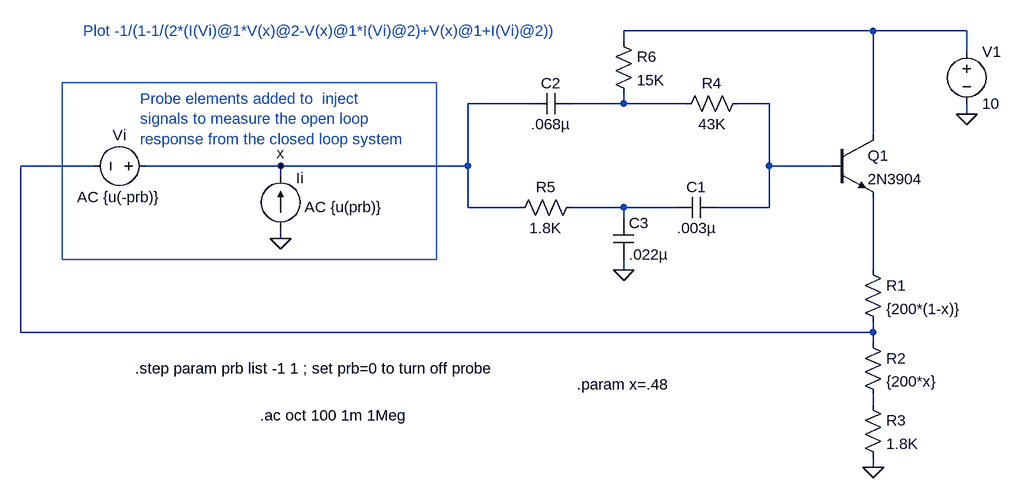
[diagram p0: schematic FollowerOSCsmallsig.asc]
FollowerOSCsmallsig.asc, the LTspice schematic file:
Version 4
SHEET 1 880 740
WIRE 352 -32 -32 -32
WIRE 496 -32 352 -32
WIRE -32 -16 -32 -32
WIRE 496 0 496 -32
WIRE -176 80 -272 80
WIRE -32 80 -32 64
WIRE -32 80 -112 80
WIRE 64 80 -32 80
WIRE 192 80 144 80
WIRE 496 96 496 80
WIRE 352 128 352 -32
WIRE -848 176 -960 176
WIRE -560 176 -768 176
WIRE -272 176 -272 80
WIRE -272 176 -560 176
WIRE 192 176 192 80
WIRE 288 176 192 176
WIRE -560 192 -560 176
WIRE -272 240 -272 176
WIRE -192 240 -272 240
WIRE -32 240 -112 240
WIRE 48 240 -32 240
WIRE 192 240 192 176
WIRE 192 240 112 240
WIRE -32 256 -32 240
WIRE -560 288 -560 272
WIRE -32 336 -32 320
WIRE 352 336 352 224
WIRE -960 432 -960 176
WIRE 352 432 352 416
WIRE 352 432 -960 432
WIRE 352 448 352 432
WIRE 352 544 352 528
WIRE 352 640 352 624
FLAG 352 640 0
FLAG -32 336 0
FLAG 496 96 0
FLAG -560 288 0
FLAG -560 176 x
SYMBOL npn 288 128 R0
SYMATTR InstName Q1
SYMATTR Value 2N3904
SYMBOL res 336 320 R0
SYMATTR InstName R1
SYMATTR Value {200*(1-x)}
SYMBOL res 336 432 R0
SYMATTR InstName R2
SYMATTR Value {200*x}
SYMBOL res 336 528 R0
SYMATTR InstName R3
SYMATTR Value 1.8K
SYMBOL res 160 64 R90
WINDOW 0 0 56 VBottom 2
WINDOW 3 32 56 VTop 2
SYMATTR InstName R4
SYMATTR Value 43K
SYMBOL res -96 224 R90
WINDOW 0 0 56 VBottom 2
WINDOW 3 32 56 VTop 2
SYMATTR InstName R5
SYMATTR Value 1.8K
SYMBOL res -48 -32 R0
SYMATTR InstName R6
SYMATTR Value 15K
SYMBOL cap 112 224 R90
WINDOW 0 0 32 VBottom 2
WINDOW 3 32 32 VTop 2
SYMATTR InstName C1
SYMATTR Value .003µ
SYMBOL cap -112 64 R90
WINDOW 0 0 32 VBottom 2
WINDOW 3 32 32 VTop 2
SYMATTR InstName C2
SYMATTR Value .068µ
SYMBOL cap -48 256 R0
SYMATTR InstName C3
SYMATTR Value .022µ
SYMBOL voltage 496 -16 R0
SYMATTR InstName V1
SYMATTR Value 10
SYMBOL current -560 272 M180
WINDOW 0 24 77 Left 2
WINDOW 3 24 0 Left 2
WINDOW 123 37 33 Left 2
WINDOW 39 0 0 Left 2
SYMATTR InstName Ii
SYMATTR Value ""
SYMATTR Value2 AC {u(prb)}
SYMBOL voltage -752 176 M270
WINDOW 0 32 56 VTop 2
WINDOW 3 -32 56 VBottom 2
WINDOW 123 -32 56 VBottom 2
WINDOW 39 -32 56 VBottom 2
SYMATTR InstName Vi
SYMATTR Value ""
SYMATTR Value2 AC {u(-prb)}
TEXT -104 512 Left 2 !.param x=.48
TEXT -776 72 Left 2 ;Probe elements added to  inject\nsignals to measure the open loop\nresponse from the closed loop system
TEXT -592 560 Left 2 !.ac oct 100 1m 1Meg
TEXT -784 488 Left 2 !.step param prb list -1 1 ; set prb=0 to turn off probe
TEXT -864 -32 Left 2 ;Plot -1/(1-1/(2*(I(Vi)@1*V(x)@2-V(x)@1*I(Vi)@2)+V(x)@1+I(Vi)@2))
RECTANGLE Normal -320 320 -896 48

The netlist it stands for:
* FollowerOSCsmallsig.asc
Q1 N001 N003 N006 0 2N3904
R1 N006 N004 {200*(1-x)}
R2 N004 N007 {200*x}
R3 N007 0 1.8K
R4 N003 N002 43K
R5 N005 x 1.8K
R6 N001 N002 15K
C1 N003 N005 .003µ
C2 N002 x .068µ
C3 N005 0 .022µ
V1 N001 0 10
Ii 0 x AC {u(prb)}
Vi x N004 AC {u(-prb)}
.model NPN NPN
.model PNP PNP
.lib standard.bjt
.param x=.48
* Probe elements added to  inject
* signals to measure the open loop
* response from the closed loop system
.ac oct 100 1m 1Meg
.step param prb list -1 1 ; set prb=0 to turn off probe
* Plot -1/(1-1/(2*(I(Vi)@1*V(x)@2-V(x)@1*I(Vi)@2)+V(x)@1+I(Vi)@2))
.backanno
.end